# Altium schematic sheet Input Protection.SchDoc
size A; SheetNumber: 3; SheetTotal: 4
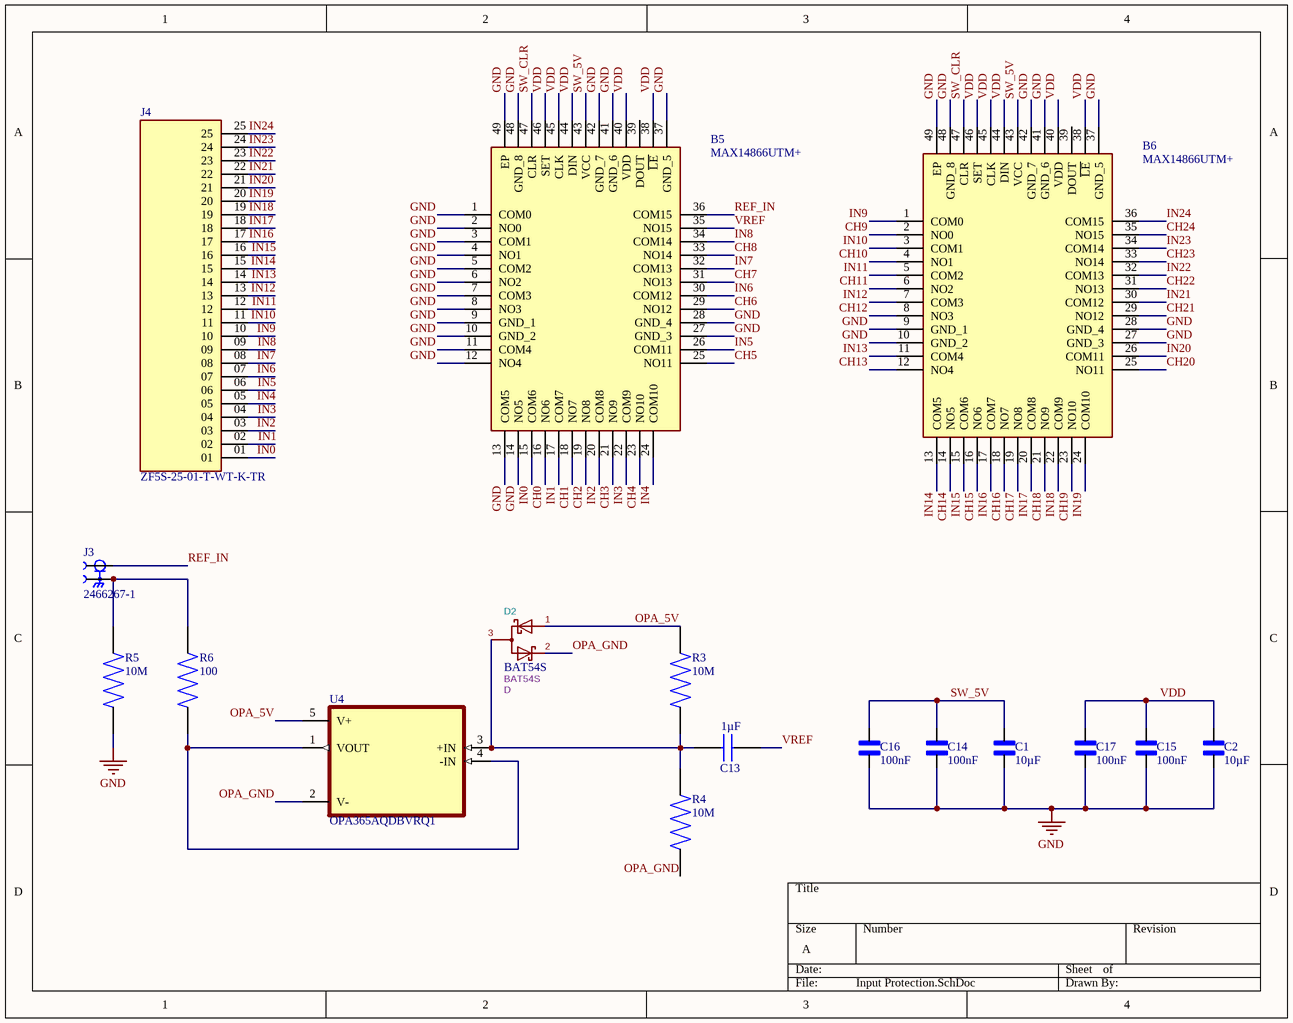
[diagram p0: Input Protection.SchDoc]

## Parts
B5  MAX14866UTM+  [QFN50P700X700X80-49N]
B6  MAX14866UTM+  [QFN50P700X700X80-49N]
C1  value 10µF  [CAPC3225X280N]  (hidden comment: C1210C106K5PACTU)
C2  value 10µF  [CAPC3225X280N]  (hidden comment: C1210C106K5PACTU)
C13  value 1µF  [CAPC7361X470N]  (hidden comment: CB057D0105JBC)
C14  value 100nF  [CAPC2012X88N]  (hidden comment: C0805C104K6RACTU)
C15  value 100nF  [CAPC2012X88N]  (hidden comment: C0805C104K6RACTU)
C16  value 100nF  [CAPC2012X88N]  (hidden comment: C0805C104K6RACTU)
C17  value 100nF  [CAPC2012X88N]  (hidden comment: C0805C104K6RACTU)
D2  BAT54S  Reference: D  [SOT-23]
J3  2466267-1  [TE_2466267-1]
J4  ZF5S-25-01-T-WT-K-TR  [SAMTEC_ZF5S-25-01-T-WT-K-TR]
R3  value 10M  [RESC2012X60N]  (hidden comment: RC0805FR-0710ML)
R4  value 10M  [RESC2012X60N]  (hidden comment: RC0805FR-0710ML)
R5  value 10M  [RESC2012X60N]  (hidden comment: RC0805FR-0710ML)
R6  value 100  [RESC2012X55N]  (hidden comment: MCU08050C1000FP500)
U4  OPA365AQDBVRQ1  [SOT95P280X145-5N]

## Nets
GND: B5.1(COM0) B5.2(NO0) B5.3(COM1) B5.4(NO1) B5.5(COM2) B5.6(NO2) B5.7(COM3) B5.8(NO3) B5.9(GND_1) B5.10(GND_2) B5.11(COM4) B5.12(NO4) B5.13(COM5) B5.14(NO5) B5.27(GND_3) B5.28(GND_4) B5.37(GND_5) B5.41(GND_6) B5.42(GND_7) B5.48(GND_8) B5.49(EP) B6.9(GND_1) B6.10(GND_2) B6.27(GND_3) B6.28(GND_4) B6.37(GND_5) B6.41(GND_6) B6.42(GND_7) B6.48(GND_8) B6.49(EP) C1.2 C2.2 C14.1 C15.1 C16.1 C17.1 R5.2
CH0: B5.16(NO6)
CH1: B5.18(NO7)
CH2: B5.19(NO8)
CH3: B5.21(NO9)
CH4: B5.23(NO10)
CH5: B5.25(NO11)
CH6: B5.29(NO12)
CH7: B5.31(NO13)
CH8: B5.33(NO14)
CH9: B6.2(NO0)
CH10: B6.4(NO1)
CH11: B6.6(NO2)
CH12: B6.8(NO3)
CH13: B6.12(NO4)
CH14: B6.14(NO5)
CH15: B6.16(NO6)
CH16: B6.18(NO7)
CH17: B6.19(NO8)
CH18: B6.21(NO9)
CH19: B6.23(NO10)
CH20: B6.25(NO11)
CH21: B6.29(NO12)
CH22: B6.31(NO13)
CH23: B6.33(NO14)
CH24: B6.35(NO15)
IN0: B5.15(COM6) J4.01
IN1: B5.17(COM7) J4.02
IN2: B5.20(COM8) J4.03
IN3: B5.22(COM9) J4.04
IN4: B5.24(COM10) J4.05
IN5: B5.26(COM11) J4.06
IN6: B5.30(COM12) J4.07
IN7: B5.32(COM13) J4.08
IN8: B5.34(COM14) J4.09
IN9: B6.1(COM0) J4.10
IN10: B6.3(COM1) J4.11
IN11: B6.5(COM2) J4.12
IN12: B6.7(COM3) J4.13
IN13: B6.11(COM4) J4.14
IN14: B6.13(COM5) J4.15
IN15: B6.15(COM6) J4.16
IN16: B6.17(COM7) J4.17
IN17: B6.20(COM8) J4.18
IN18: B6.22(COM9) J4.19
IN19: B6.24(COM10) J4.20
IN20: B6.26(COM11) J4.21
IN21: B6.30(COM12) J4.22
IN22: B6.32(COM13) J4.23
IN23: B6.34(COM14) J4.24
IN24: B6.36(COM15) J4.25
OPA_5V: D2.1(A) R3.1 U4.5(V+)
OPA_GND: D2.2(C) R4.2 U4.2(V-)
REF_IN: B5.36(COM15) J3.1(SIG)
SW_5V: B5.43(VCC) B6.43(VCC) C1.1 C14.2 C16.2
SW_CLR: B5.47(CLR) B6.47(CLR)
VDD: B5.38(~{LE}) B5.40(VDD) B5.44(DIN) B5.45(CLK) B5.46(SET) B6.38(~{LE}) B6.40(VDD) B6.44(DIN) B6.45(CLK) B6.46(SET) C2.1 C15.2 C17.2
VREF: B5.35(NO15) C13.2
NetC13_1: C13.1 D2.3 R3.2 R4.1 U4.3(+IN)
NetJ3_2: J3.2(SH) J3.3(SH) J3.4(SH) J3.5(SH) R5.1 R6.1
NetR6_2: R6.2 U4.1(VOUT) U4.4(-IN)

Not connected (* = marked no-connect by the designer): B5 39(DOUT); B6 39(DOUT)

## Library data of the parts
B5 B6 = CMP-011-00013-2: MAXIM INTEGRATED PRODUCTS - MAX14866UTM+ - ANALOGUE SWITCH, 16 CH, SPST, TQFN-16; Manufacturer_Name: Analog Devices; Geometry.Height: 0.8mm; Arrow Price/Stock: https://www.arrow.com/en/products/max14866utm/analog-devices?utm_currency=USD&region=nac; Design Item ID: MAX14866UTM+; Mouser Part Number: 700-MAX14866UTM+; Source: MAX14866UTM+.SchLib; Arrow Part Number: MAX14866UTM+; Mouser Price/Stock: https://www.mouser.co.uk/ProductDetail/Analog-Devices-Maxim-Integrated/MAX14866UTM%2b?qs=1mbolxNpo8f6nC88ZZmOdg%3D%3D; Manufacturer_Part_Number: MAX14866UTM+; Datasheet Link: https://www.mouser.com/datasheet/2/256/MAX14866-1154497.pdf
C1 C2 = CMP-001-00085-1: 10 ÂµF Â±10% 50V Ceramic Capacitor X5R 1210 (3225 Metric); MF: KEMET; Source: C1210C106K5PACTU.SchLib; Pins: 2; Check_prices: https://www.snapeda.com/parts/C1210C106K5PACTU/KEMET/view-part/?ref=eda; Design Item ID: C1210C106K5PACTU; Component Type: Standard; MP: C1210C106K5PACTU; Case/Package: 3225 KEMET; SnapEDA_Link: https://www.snapeda.com/parts/C1210C106K5PACTU/KEMET/view-part/?ref=snap
C13 = CMP-001-00089-2: 1 F Film Capacitor 40V 63V Polyester, Polyethylene Naphthalate (PEN), Metallized - Stacked 2824 (7260 Metric); Manufacturer_Name: Kyocera AVX; Geometry.Height: 4.7mm; Manufacturer_Part_Number: CB057D0105JBC; Source: CB057D0105JBC.SchLib; Farnell Part Number: *; Design Item ID: CB057D0105JBC; Farnell Price/Stock: *; Datasheet Link: https://datasheets.kyocera-avx.com/cb-pen.pdf
C14-C17 = CMP-001-00084-1: 0.1 ÂµF Â±10% 35V Ceramic Capacitor X7R 0805 (2012 Metric); MF: KEMET; Source: C0805C104K6RACTU.SchLib; SnapEDA_Link: https://www.snapeda.com/parts/C0805C104K6RACTU/KEMET/view-part/?ref=snap; MP: C0805C104K6RACTU; Pins: 2; Check_prices: https://www.snapeda.com/parts/C0805C104K6RACTU/KEMET/view-part/?ref=eda; Case/Package: 805-2 KEMET; Design Item ID: C0805C104K6RACTU; Component Type: Standard
D2 = CMP-004-00037-1: ki_description: Dual Schottky Diode in Series; ki_keywords: Dual Schottky Diode Series; Value: BAT54S; Datasheet: https://diotec.com/request/datasheet/bat54.pdf; Design Item ID: BAT54S; Pins: 3; Component Type: Standard; Source: BAT54S.SchLib
J3 = CMP-019-000000-2: BNC connector; Source: 2466267-1.SchLib; MP: 2466267-1; Package: None; Price: None; Component Type: Standard; Availability: Unavailable; Pin Count: 5; Design Item ID: 2466267-1; Value: *
J4 = CMP-084-000000-2: 25 Conductor ZIF connector; Pin Count: 25; MP: ZF5S-25-01-T-WT-K-TR; Design Item ID: ZF5S-25-01-T-WT-K-TR; Price: None; Source: ZF5S-25-01-T-WT-K-TR.SchLib; Value: *; Component Type: Standard; Availability: Unavailable; Package: None
R3-R5 = CMP-009-00180-1: 10 MOhms Â±1% 0.125W, 1/8W Chip Resistor 0805 (2012 Metric) Moisture Resistant Thick Film; MF: Yageo; SnapEDA_Link: https://www.snapeda.com/parts/RC0805FR-0710ML/Yageo/view-part/?ref=snap; Design Item ID: RC0805FR-0710ML; Pins: 2; MP: RC0805FR-0710ML; Component Type: Standard; Source: RC0805FR-0710ML.SchLib; Case/Package: 2012 Yageo; Check_prices: https://www.snapeda.com/parts/RC0805FR-0710ML/Yageo/view-part/?ref=eda
R6 = CMP-009-00181-1: Res Thin Film 0805 100 Ohm 1% 0.125W(1/8W) ?50ppm/C Molded SMD Automotive Medical Paper T/R; MF: Vishay Beyschlag; Case/Package: 2012 Vishay; SnapEDA_Link: https://www.snapeda.com/parts/MCU08050C1000FP500/Vishay/view-part/?ref=snap; Check_prices: https://www.snapeda.com/parts/MCU08050C1000FP500/Vishay/view-part/?ref=eda; Component Type: Standard; Pins: 2; Design Item ID: MCU08050C1000FP500; MP: MCU08050C1000FP500; Source: MCU08050C1000FP500.SchLib
U4 = CMP-014-00002-1: Automotive 2.2V, 50MHz, Low-Noise, Single-Supply Rail-to-Rail Operational Amplifier; MF: Texas Instruments; Design Item ID: OPA365AQDBVRQ1; Source: OPA365AQDBVRQ1.SchLib; Component Type: Standard; Case/Package: SOT-23-5 Texas Instruments; Pins: 5; Value: *; MP: OPA365AQDBVRQ1; Check_prices: https://www.snapeda.com/parts/OPA365AQDBVRQ1/Texas+Instruments/view-part/?ref=eda; SnapEDA_Link: https://www.snapeda.com/parts/OPA365AQDBVRQ1/Texas+Instruments/view-part/?ref=snap